# Altium schematic sheet Motor-BLDC.SchDoc
size A3; SheetNumber: 1; SPICEModelCacheQVBBULDQ: <root> / <DocumentId>QVBBULDQ</DocumentId> / <CacheFrame Number="0"> / <Model Name="dpsw2" Kind="CKT"> / <Text>* DIP switch 2 / * jjt 19/6/2002: created / * / *             Switch connections: / *             sw1 / *             |  |  sw2 / *             |  |  |  | / *             |  |  |  | / .subckt dpsw2 1  2  4  5 / + PARAMS: STATE1=0 STATE2=0 RON=1m ROFF=100E6 / * / V1 3 0 {STATE1} / V2 6 0 {STATE2} / * / SDIP1 1 2 3 0 DIPMOD / SDIP2 4 5 6 0 DIPMOD / * / .MODEL DIPMOD SW(VT=0.5 RON={RON} ROFF={ROFF}) / .ends dpsw2</Text> / </Model> / </CacheFrame> / </root>
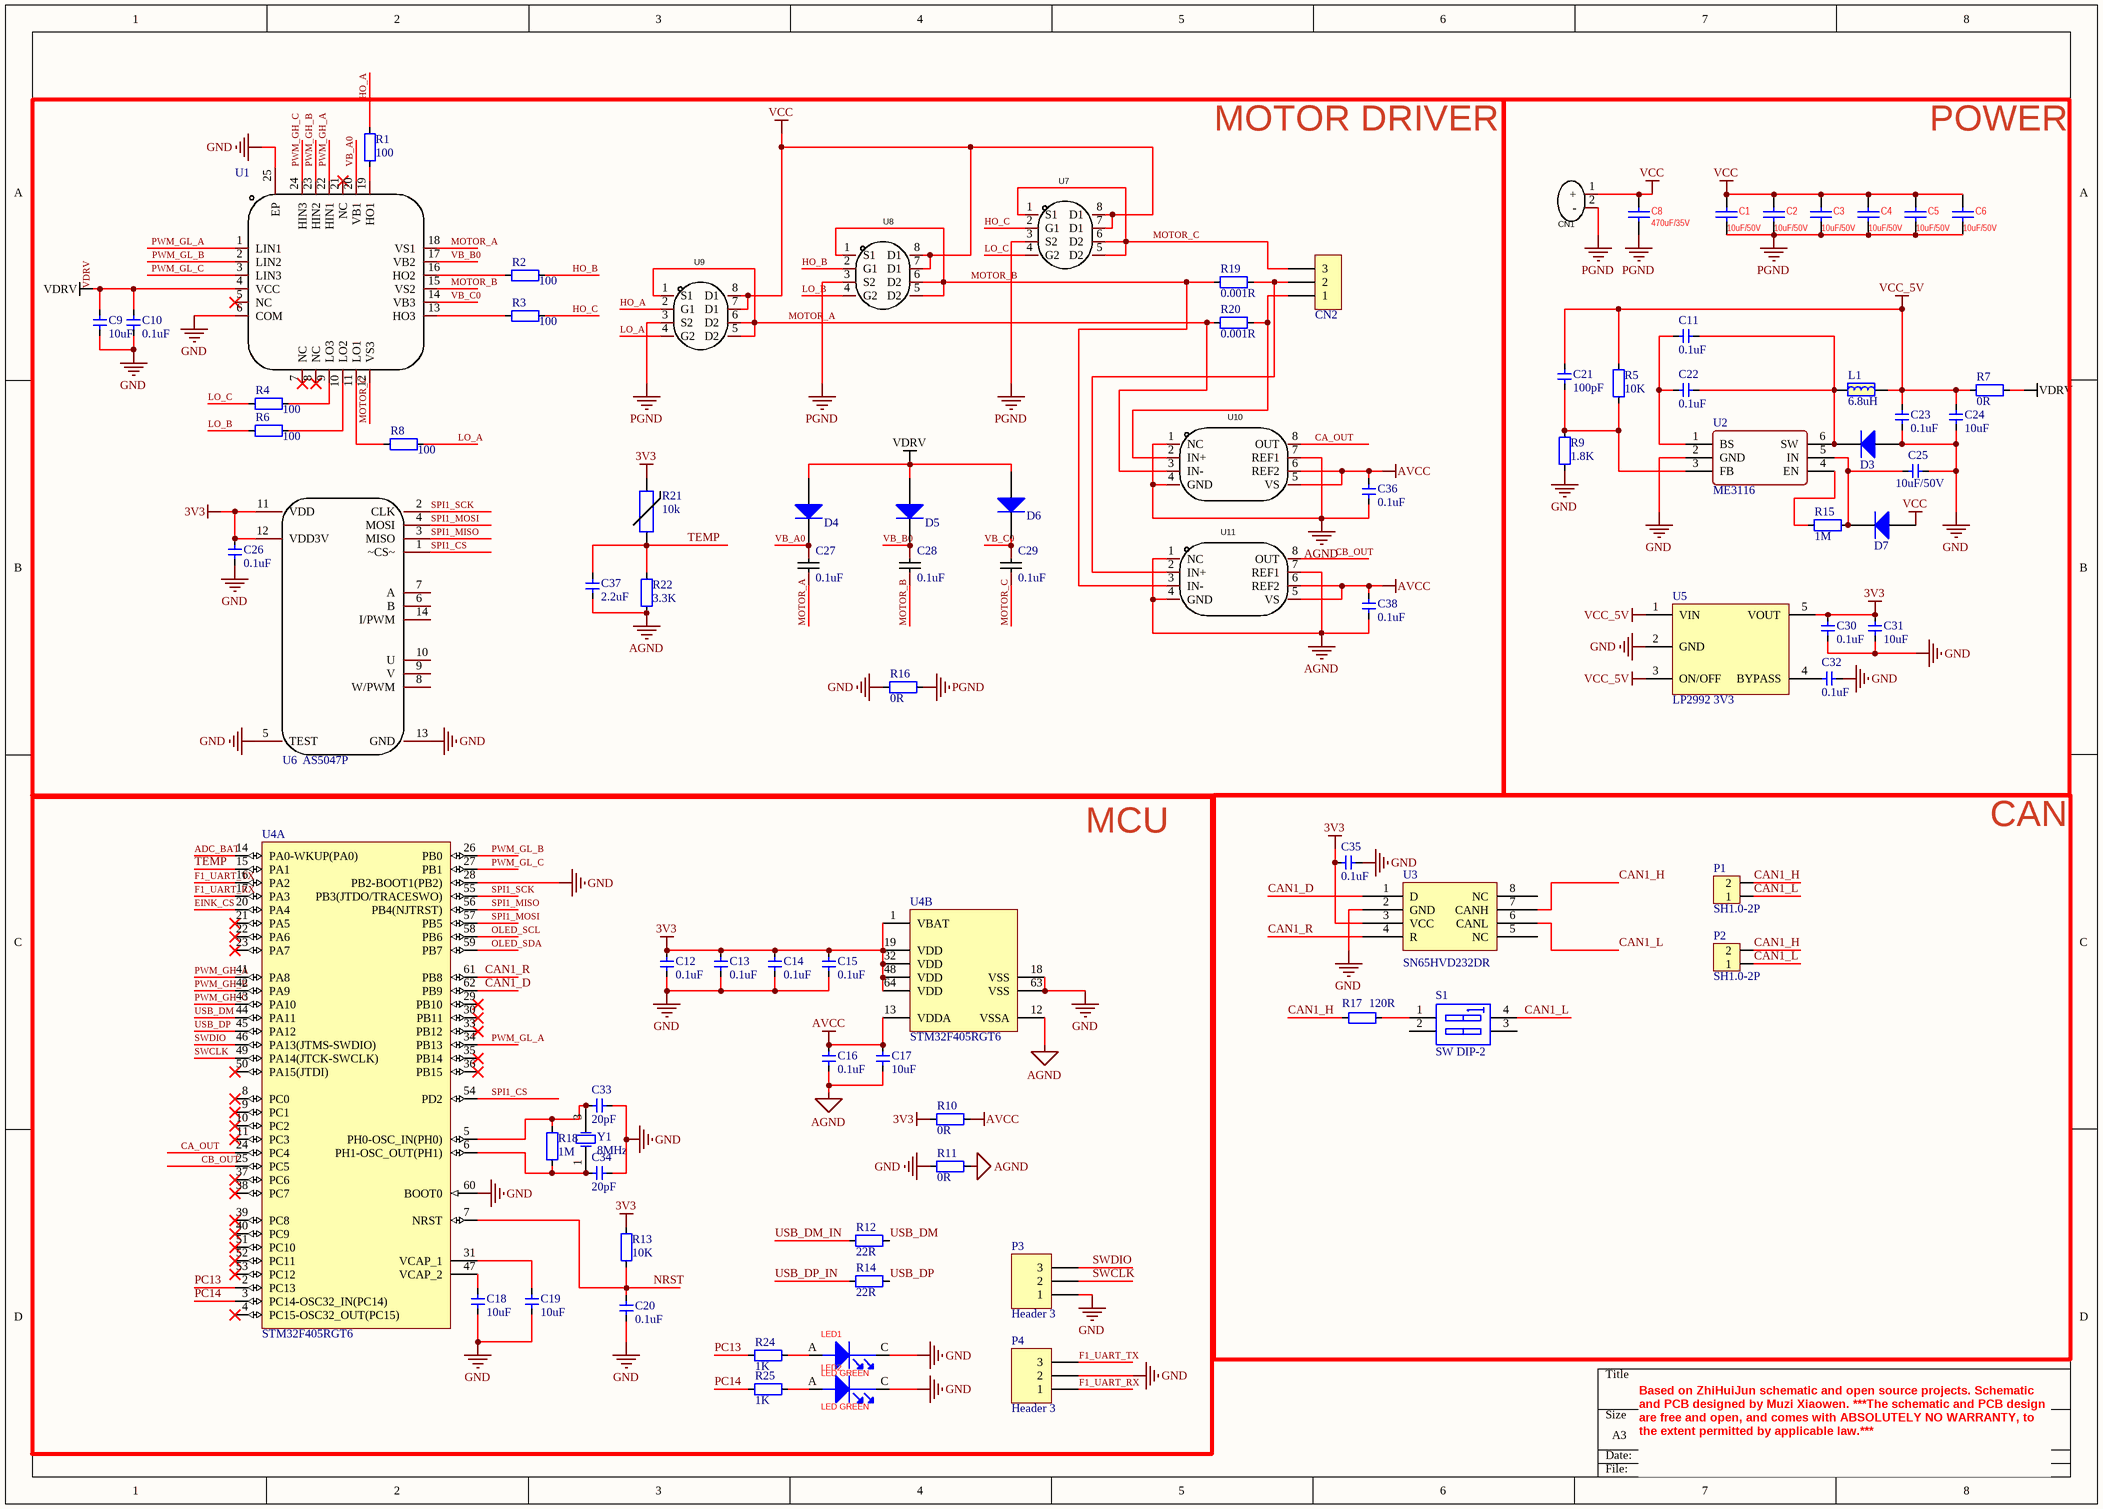
[diagram p0: Motor-BLDC.SchDoc]

## Parts
C1  10uF/50V  [1206-CAP]
C2  10uF/50V  [1206-CAP]
C3  10uF/50V  [1206-CAP]
C4  10uF/50V  [1206-CAP]
C5  10uF/50V  [1206-CAP]
C6  10uF/50V  [1206-CAP]
C8  value 470uF/35V  [CAP-SMD_BD8.0-L8.3-W8.3-LS9.3]  (hidden comment: 220uF/25V)
C9  10uF  [CAP_0402]
C10  0.1uF  [CAP_0402]
C11  0.1uF  [CAP_0402]
C12  0.1uF  [CAP_0402]
C13  0.1uF  [CAP_0402]
C14  0.1uF  [CAP_0402]
C15  0.1uF  [CAP_0402]
C16  0.1uF  [CAP_0402]
C17  10uF  [CAP_0402]
C18  10uF  [CAP_0402]
C19  10uF  [CAP_0402]
C20  0.1uF  [CAP_0402]
C21  100pF  [CAP_0402]
C22  0.1uF  [CAP_0402]
C23  0.1uF  [CAP_0402]
C24  10uF  [CAP_0402]
C25  10uF/50V  [1206-CAP]
C26  0.1uF  [CAP_0402]
C27  value 0.1uF  [CAP_0402]  (hidden comment: CC0402MRX5R5BB106)
C28  value 0.1uF  [CAP_0402]  (hidden comment: CC0402MRX5R5BB106)
C29  value 0.1uF  [CAP_0402]  (hidden comment: CC0402MRX5R5BB106)
C30  0.1uF  [CAP_0402]
C31  10uF  [CAP_0402]
C32  0.1uF  [CAP_0402]
C33  20pF  [CAP_0402]
C34  20pF  [CAP_0402]
C35  0.1uF  [CAP_0402]
C36  0.1uF  [CAP_0402]
C37  2.2uF  [CAP_0402]
C38  0.1uF  [CAP_0402]
CN1  XT30UPB-F30.G.Y  [CONN-TH_XT30UPB-F]  (value not drawn)
CN2  1704936  [MR30PW-M]  (value not drawn)
D3  二极管-5819W  [SOD-323]  (value not drawn)
D4  二极管-5819W  [SOD-323]  (value not drawn)
D5  二极管-5819W  [SOD-323]  (value not drawn)
D6  二极管-5819W  [SOD-323]  (value not drawn)
D7  二极管-5819W  [SOD-323]  (value not drawn)
L1  6.8uH  [IND-201612]
LED1  LED GREEN  [LED-0603]
LED2  LED GREEN  [LED-0603]
P1  SH1.0-2P  [SH1.0-2P]
P2  SH1.0-2P  [SH1.0-2P]
P3  Header 3  [HDR1X3]
P4  Header 3  [HDR1X3]
R1  100  [RES_0402]
R2  100  [RES_0402]
R3  100  [RES_0402]
R4  100  [RES_0402]
R5  10K  [RES_0402]
R6  100  [RES_0402]
R7  0R  [1206-RES]
R8  100  [RES_0402]
R9  1.8K  [RES_0402]
R10  0R  [RES_0402]
R11  0R  [RES_0402]
R12  22R  [RES_0402]
R13  10K  [RES_0402]
R14  22R  [RES_0402]
R15  1M  [RES_0402]
R16  0R  [1206-RES]
R17  120R  [RES_0402]
R18  1M  [RES_0402]
R19  0.001R  [2512-RES]
R20  0.001R  [2512-RES]
R21  value 10k  [RES_0402]  (hidden comment: NCP15XH103F03RC)
R22  3.3K  [RES_0402]
R24  1K  [RES_0402]
R25  1K  [RES_0402]
S1  SW DIP-2  [SW-SMD_DSHP02]
U1  FD6288Q  [QFN-24_L4.0-W4.0-P0.50-BL]  (value not drawn)
U2  ME3116  [SOT23-6]
U3  Manufacturer Part Number: SN65HVD232DR  [SO-8]  (hidden comment: SN65HVD232D)
U4  STM32F405RGT6  [LQFP-64_N]  (parts A,B of 2)
U5  LP2992 3V3  [SOT23-5]
U6  AS5047P  [TSSOP14]
U7  AP90N03GD  [DFN-8_L5.8-W4.9-P1.27-LS6.0]  (value not drawn)
U8  AP90N03GD  [DFN-8_L5.8-W4.9-P1.27-LS6.0]  (value not drawn)
U9  AP90N03GD  [DFN-8_L5.8-W4.9-P1.27-LS6.0]  (value not drawn)
U10  INA240A1PWR  [INA240]  (value not drawn)
U11  INA240A1PWR  [INA240]  (value not drawn)
Y1  value 8MHz  [LC-SMD-3225_4P]  (hidden comment: XTAL-4)

## Blocks framed on the sheet
MOTOR DRIVER: C9 C10 C26-C29 C36-C38 CN2 D4-D6 R1-R4 R6 R8 R16 R19-R22 U1 U6-U11
POWER: C1-C6 C8 C11 C21-C25 C30-C32 CN1 D3 D7 L1 R5 R7 R9 R15 U2 U5
MCU: C12-C20 C33 C34 LED1 LED2 P3 P4 R10-R14 R18 R24 R25 U4 Y1
CAN: C35 P1 P2 R17 S1 U3

## Nets
3V3: C12.2 C13.2 C14.2 C15.2 C26.2 C30.2 C31.2 C35.2 R10.2 R13.2 R21.2 U3.3(VCC) U4.1(VBAT) U4.19(VDD) U4.32(VDD) U4.48(VDD) U4.64(VDD) U5.5(VOUT) U6.11(VDD) U6.12(VDD3V)
AGND: C16.1 C17.1 C36.1 C37.1 C38.1 R11.1 R22.1 U4.12(VSSA) U10.1(NC) U10.4(GND) U10.7(REF1) U11.1(NC) U11.4(GND) U11.7(REF1)
AVCC: C16.2 C17.2 C36.2 C38.2 R10.1 U4.13(VDDA) U10.5(VS) U10.6(REF2) U11.5(VS) U11.6(REF2)
GND: C9.1 C10.1 C12.1 C13.1 C14.1 C15.1 C18.1 C19.1 C20.1 C23.1 C24.1 C25.1 C26.1 C30.1 C31.1 C32.1 C33.2 C34.2 C35.1 D3.1(A) LED1.C(CATHODE) LED2.C(CATHODE) P3.1 P4.2 R9.1 R11.2 R16.1 U1.6(COM) U1.25(EP) U2.2(GND) U3.2(GND) U4.18(VSS) U4.28(PB2-BOOT1(PB2)) U4.60(BOOT0) U4.63(VSS) U5.2(GND) U6.5(TEST) U6.13(GND)
PGND: C1.2 C2.2 C3.2 C4.2 C5.2 C6.2 C8.2 CN1.2(-) R16.2 U7.3(S2) U8.3(S2) U9.3(S2)
VCC: C1.1 C2.1 C3.1 C4.1 C5.1 C6.1 C8.1 CN1.1(+) D7.1(A) U7.7(D1) U7.8(D1) U8.7(D1) U8.8(D1) U9.7(D1) U9.8(D1)
VCC_5V: C21.1 C23.2 C24.2 L1.2 R5.2 R7.1 U5.1(VIN) U5.3(ON/OFF)
VDRV: C9.2 C10.2 D4.1(A) D5.1(A) D6.1(A) R7.2 U1.4(VCC)
ADC_BAT: U4.14(PA0-WKUP(PA0))
CA_OUT: U4.24(PC4) U10.8(OUT)
CAN1_D: U3.1(D) U4.62(PB9)
CAN1_H: P1.2 P2.2 R17.1 U3.7(CANH)
CAN1_L: P1.1 P2.1 S1.4(B1) U3.6(CANL)
CAN1_R: U3.4(R) U4.61(PB8)
CB_OUT: U4.25(PC5) U11.8(OUT)
EINK_CS: U4.20(PA4)
F1_UART_RX: P4.1 U4.17(PA3)
F1_UART_TX: P4.3 U4.16(PA2)
HO_A: R1.1 U9.2(G1)
HO_B: R2.1 U8.2(G1)
HO_C: R3.1 U7.2(G1)
LO_A: R8.1 U9.4(G2)
LO_B: R6.2 U8.4(G2)
LO_C: R4.2 U7.4(G2)
MOTOR_A: C27.1 R20.1 U1.18(VS1) U9.1(S1) U9.5(D2) U9.6(D2) U10.3(IN-)
MOTOR_B: C28.1 R19.1 U1.15(VS2) U8.1(S1) U8.5(D2) U8.6(D2) U11.3(IN-)
MOTOR_C: C29.1 CN2.3 U1.12(VS3) U7.1(S1) U7.5(D2) U7.6(D2)
NRST: C20.2 R13.1 U4.7(NRST)
OLED_SCL: U4.58(PB6)
OLED_SDA: U4.59(PB7)
PC13: R24.1 U4.2(PC13)
PC14: R25.1 U4.3(PC14-OSC32_IN(PC14))
PWM_GH_A: U1.22(HIN1) U4.41(PA8)
PWM_GH_B: U1.23(HIN2) U4.42(PA9)
PWM_GH_C: U1.24(HIN3) U4.43(PA10)
PWM_GL_A: U1.1(LIN1) U4.34(PB13)
PWM_GL_B: U1.2(LIN2) U4.26(PB0)
PWM_GL_C: U1.3(LIN3) U4.27(PB1)
SPI1_CS: U4.54(PD2) U6.1(~CS~)
SPI1_MISO: U4.56(PB4(NJTRST)) U6.3(MISO)
SPI1_MOSI: U4.57(PB5) U6.4(MOSI)
SPI1_SCK: U4.55(PB3(JTDO/TRACESWO)) U6.2(CLK)
SWCLK: P3.2 U4.49(PA14(JTCK-SWCLK))
SWDIO: P3.3 U4.46(PA13(JTMS-SWDIO))
TEMP: C37.2 R21.1 R22.2 U4.15(PA1)
USB_DM: R12.1 U4.44(PA11)
USB_DM_IN: R12.2
USB_DP: R14.1 U4.45(PA12)
USB_DP_IN: R14.2
VB_A0: C27.2 D4.2(K) U1.20(VB1)
VB_B0: C28.2 D5.2(K) U1.17(VB2)
VB_C0: C29.2 D6.2(K) U1.14(VB3)
NetC11_1: C11.1 C22.1 D3.2(K) L1.1 U2.6(SW)
NetC11_2: C11.2 C22.2 U2.1(BS)
NetC18_2: C18.2 U4.47(VCAP_2)
NetC19_2: C19.2 U4.31(VCAP_1)
NetC21_2: C21.2 R5.1 R9.2 U2.3(FB)
NetC25_2: C25.2 D7.2(K) R15.1 U2.5(IN)
NetC32_2: C32.2 U5.4(BYPASS)
NetC33_1: C33.1 R18.1 U4.5(PH0-OSC_IN(PH0)) Y1.3(OSC2)
NetC34_1: C34.1 R18.2 U4.6(PH1-OSC_OUT(PH1)) Y1.1(OSC1)
NetCN2_1: CN2.1 R20.2 U10.2(IN+)
NetCN2_2: CN2.2 R19.2 U11.2(IN+)
NetLED1_A: LED1.A(ANODE) R24.2
NetLED2_A: LED2.A(ANODE) R25.2
NetR1_2: R1.2 U1.19(HO1)
NetR2_2: R2.2 U1.16(HO2)
NetR3_2: R3.2 U1.13(HO3)
NetR4_1: R4.1 U1.9(LO3)
NetR6_1: R6.1 U1.10(LO2)
NetR8_2: R8.2 U1.11(LO1)
NetR15_2: R15.2 U2.4(EN)
NetR17_2: R17.2 S1.1(A1)

Not connected (* = marked no-connect by the designer): S1 2(A2) 3(B2); U1 5(NC)* 7(NC)* 8(NC)* 21(NC)*; U3 5(NC) 8(NC); U4 4(PC15-OSC32_OUT(PC15))* 8(PC0)* 9(PC1)* 10(PC2)* 11(PC3)* 21(PA5)* 22(PA6)* 23(PA7)* 29(PB10)* 30(PB11)* 33(PB12)* 35(PB14)* 36(PB15)* 37(PC6)* 38(PC7)* 39(PC8)* 40(PC9)* 50(PA15(JTDI))* 51(PC10)* 52(PC11)* 53(PC12)*; U6 6(B) 7(A) 8(W/PWM) 9(V) 10(U) 14(I/PWM)

## Notes on the sheet
- Based on ZhiHuiJun schematic and open source projects. Schematic and PCB designed by Muzi Xiaowen. ***The schematic and PCB design are free and open, and comes with ABSOLUTELY NO WARRANTY, to the extent permitted by applicable law.***

## Library data of the parts
C1-C6 C8 = CAP: Capacitor, chip, ceramic; Parameters: E22 CAP; PN: RVT1E221M0607; Price: 0.038
  C1-C6: Value: 10uF/50V
C9-C26 C30-C32 C35-C38 = 电容-0402: Capacitor; Value: 0.1u
C27-C29 = CC0402MRX5R5BB106: 容值:10uF;精度:±20%;额定电压:6.3V;温度系数:X5R;; Manufacturer: YAGEO(国巨); Add into BOM: yes; Tolerance: ±20%; Voltage Rated: 6.3V; Temperature Coefficient: X5R; Symbol: CC0402MRX5R5BB106; Device: CC0402MRX5R5BB106; LCSC Part Name: 10uF ±20% 6.3V; Supplier Part: C105884; Manufacturer Part: CC0402MRX5R5BB106; Supplier Footprint: 0402; Datasheet: https://atta.szlcsc.com/upload/public/pdf/source/20170728/C105884_1501225684064848716.pdf; Supplier: LCSC; Convert to PCB: yes
C33 C34 = 电容-0402: Capacitor; Value: 20pF
CN1 = XT30UPB-F30.G.Y: Manufacturer: AMASS(艾迈斯); Add into BOM: yes; Name: XT30UPB-F30.G.Y; Symbol: XT30UPB-F; Device: XT30UPB-F30.G.Y; LCSC Part Name: AMASS(艾迈斯)直立焊板式连接器XT30UPB30-F.G.*; Supplier Part: C108769; Manufacturer Part: XT30UPB-F30.G.Y; Supplier Footprint: -; JLCPCB Part Class: Extended Part; Datasheet: https://atta.szlcsc.com/upload/public/pdf/source/20220715/AFD68B9E8B6CA95A7295DBF4AF9325E4.pdf; Supplier: LCSC; Convert to PCB: yes
CN2 = 1704936: CONN TERM BLOCK 3POS 7.62MM; Manufacturer: Phoenix Contact; Number of Levels: 1; Positions Per Level: 3; Pitch: 0.300" (7.62mm); Mating Orientation: Horizontal with Board; Current: 30A; Voltage: 300V; Wire Gauge: 10-30 AWG; Wire Termination: Screw - Rising Cage Clamp; Torque - Screw: 0.5-0.6 Nm (4.4-5.3 Lb-In); Screw Thread: M3; Supplier 1: Digi-Key; Supplier Part Number 1: 277-5954-ND; RoHS: RoHS Compliant; Category: Connectors, Interconnects; Stock: 3559; Pricing 1: 1=2.19, 10=2.128, 50=1.989, 100=1.8299, 250=1.69064, 500=1.61108, 1000=1.482 (USD); Packaging: Bulk; Part Status: Active; Mounting Type: Through Hole; Features: Interlocking (Side); Color: Green; Operating Temperature: -; Housing Material: Polyamide (PA), Nylon; Contact Material - Plating: -; Clamp Material - Plating: -; Screw Material - Plating: -; ComponentLink1URL: http://media.digikey.com/PDF/Data%20Sheets/Phoenix%20Contact%20PDFs/1704936.pdf; ComponentLink1Description: http://media.digikey.com/PDF/Data%20Sheets/Phoenix%20Contact%20PDFs/1704936.pdf; Manufacturer Part Number: 1704936
D3-D7 = 二极管-5819W: 40V
L1 = 电感-201612
LED1 LED2 = LED: LED GRN SGL RA 25mA 4.1V SMD; CLASS: IC; CAD_APPROVED: Yes; MFG_PN01: AA4040ZGS; MFG_NAME01: Kingbright; AGILE_PN: 370-76642; PN: 19-217/G7C-AN1P2/3T; HEIGHT: 4.25MM; ROHS: Yes
P3 P4 = Header 3: Header, 3-Pin; LatestRevisionDate: 17-Jul-2002; LatestRevisionNote: Re-released for DXP Platform.; Publisher: Altium Limited
R1-R4 R6 R8 R12 R14 = 电阻-0402: Resistor
  R1-R4 R6 R8: Value: 100
  R12 R14: Value: 22R
R5 R9-R11 R13 R15 R17 R18 R22 R24 R25 = 电阻-0402: Resistor; Value: 22R
R7 R16 = 电阻-1206: Resistor; Value: 0R
R19 R20 = 电阻-1206: Resistor; Value: 0R
R21 = NCP15XH103F03RC: THERMISTOR 10K OHM NTC 0402 SMD
S1 = SW DIP-2: DIP Switch, 2 Position, SPST; Published: 24-Mar-1999; LatestRevisionDate: 17-Jul-2002; LatestRevisionNote: Re-released for DXP Platform.; PackageReference: DIP-4; Publisher: Altium Limited
U1 = FD6288Q: Manufacturer: Fortior Tech(峰岹); Symbol: FD6288Q_C328453; Add into BOM: yes; Device: FD6288Q; LCSC Part Name: FD6288Q; Supplier Part: C328453; Manufacturer Part: FD6288Q; Supplier Footprint: QFN-24; JLCPCB Part Class: Extended Part; Datasheet: https://atta.szlcsc.com/upload/public/pdf/source/20181108/C328453_785547738DB9FC0123219FC22539EFAD.pdf; Supplier: LCSC; Convert to PCB: yes
U2 = ME3116: DC-DC
U3 = SN65HVD232D: Manufacturer: Texas Instruments; Protocol: CAN; Number of Drivers/Receivers: 1/1; Duplex: Half; Data Rate: 1Mbps; Voltage - Supply: 3 V ~ 3.6 V; Supplier 1: Digi-Key; Supplier Part Number 1: 296-26344-2-ND; RoHS: RoHS Compliant; Category: Integrated Circuits (ICs); Stock: 5000; Pricing 1: 2500=0.84375 (USD); Packaging: Tape & Reel (TR); Part Status: Active; Type: Transceiver; Operating Temperature: -40°C ~ 85°C; Mounting Type: Surface Mount; Package / Case: 8-SOIC (0.154", 3.90mm Width); Supplier Device Package: 8-SOIC; ComponentLink1URL: http://www.ti.com/lit/ds/symlink/sn65hvd230.pdf; ComponentLink1Description: http://www.ti.com/lit/ds/symlink/sn65hvd230.pdf; Supplier 2: Digi-Key; Supplier Part Number 2: 296-26344-1-ND; Pricing 2: 1=2.05, 10=1.842, 100=1.4809, 500=1.21668, 1000=1.00811 (USD)
U4 = STM32F405RGT6: ARM Cortex-M4 32-bit MCU+FPU, 210 DMIPS, 1024 kB Flash, 192 kB Internal RAM, 51 I/Os, 64-pin LQFP, -40 to 85 degC, Tray; Manufacturer: STMicroelectronics; D/A Converter: 2x12-bit; FLASH Size (Prog) (kB): 1024; I/Os (High Current): 51; Internal RAM Size (kB): 192; Operating Frequency(F) (Processor speed) (MHz): 168; Supply Voltage(Vcc) max (V): 3.6; Supply Voltage(Vcc) min (V): 1.8; DatasheetVersion: Rev. 4; PackageVersion: Rev. 4, 06/2013; PackageReference: LQFP64; PackageDescription: 64-Pin Low Profile Quad Flat Package, 10 x 10 mm Body, 0.5 mm Pitch; Supplier 1: Digi-Key; Supplier Part Number 1: 497-11767-ND; Supplier 2: Farnell; Supplier Part Number 2: 2064363; Supplier 3: Newark; Supplier Part Number 3: 73T2329; Supplier 4: Mouser; Supplier Part Number 4: 511-STM32F405RGT6; Core: ARM Cortex-M4; Packing: Tray; Mounting Technology: Surface Mount; PartNumber: STM32F405RGT6; ComponentLink1Description: Manufacturer URL; ComponentLink1URL: http://www.st.com/web/en/home.html; ComponentLink2Description: Datasheet; ComponentLink2URL: http://www.st.com/st-web-ui/static/active/en/resource/technical/document/datasheet/DM00037051.pdf; ComponentLink3Description: Package Specification; ComponentLink3URL: http://www.st.com/st-web-ui/static/active/en/resource/technical/document/datasheet/DM00037051.pdf
U5 = LP2992: LDO
U6 = AS5047P: Add into BOM: yes; Origin Footprint: TSSOP-14; Name: AS5047P; Symbol: AS5047P; Device: AS5047P; Convert to PCB: yes
U7-U9 = AP90N03GD: Manufacturer: ALLPOWER(铨力); Add into BOM: yes; Drain Source Voltage (Vdss): 30V; Continuous Drain Current (Id): 80A; Power Dissipation (Pd): 90W; Drain Source On Resistance (RDS(on)@Vgs,Id): 5.2mΩ@10V,30A; Gate Threshold Voltage (Vgs(th)@Id): 1.5V@250uA; Total Gate Charge (Qg@Vgs): 42nC@10V; Input Capacitance (Ciss@Vds): 1.95nF@15V; Reverse Transfer Capacitance (Crss@Vds): 240pF@15V; Name: AP90N03GD; Symbol: AP90N03GD; Device: AP90N03GD; LCSC Part Name: 2个N沟道 30V 80A; Supplier Part: C3013877; Manufacturer Part: AP90N03GD; Supplier Footprint: PDFN-8(5x6); JLCPCB Part Class: Extended Part; Datasheet: https://atta.szlcsc.com/upload/public/pdf/source/20220909/6D778845F2E2114ABED9A48357740A1D.pdf; Supplier: LCSC; Convert to PCB: yes; Type: 2个N沟道; Operating Temperature: +150℃@(Tj)
U10 U11 = INA240A1PWR: Manufacturer: TI(德州仪器); Add into BOM: yes; Number of Channels: 1; Supply Current: 1.8mA; Name: INA240A1PWR; Symbol: INA240A1PWR; Device: INA240A1PWR; LCSC Part Name: INA240A1PWR; Supplier Part: C93965; Manufacturer Part: INA240A1PWR; Supplier Footprint: TSSOP-8; JLCPCB Part Class: Extended Part; Datasheet: https://www.ti.com/cn/lit/gpn/ina240; Supplier: LCSC; Convert to PCB: yes; Operating Temperature: -40℃~+125℃
Y1 = XTAL-4: Crystal; Parameters: 20ppm 20pF -20/+70C; Manufacturer: *; Distributors: Comet; Price: 0.238